# Altium schematic sheet EPS_MPPT_Y_OR_MPB.SchDoc: MPPT-Y / MPB ORing
size A4; SheetNumber: 23; SheetTotal: 51
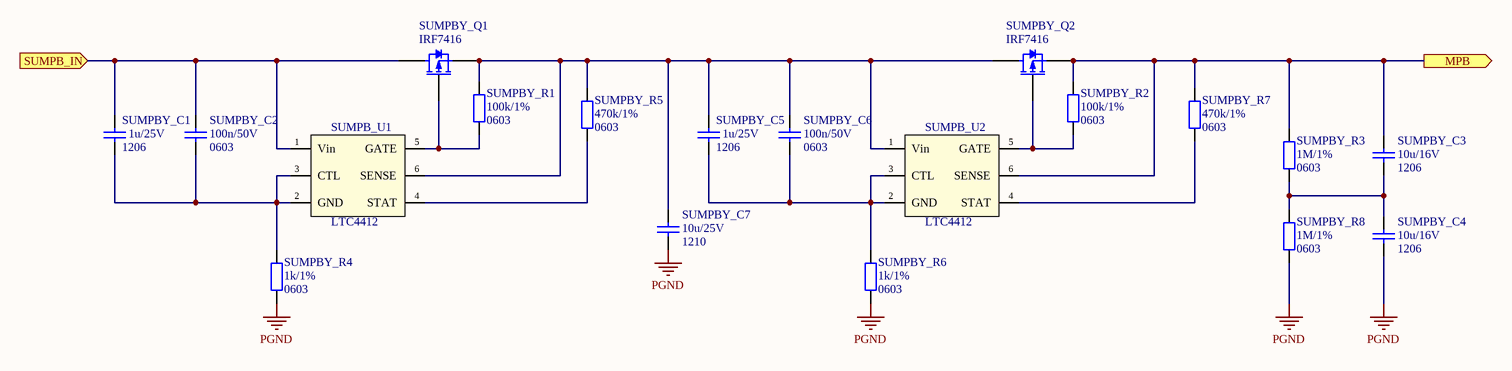
[diagram p0: EPS_MPPT_Y_OR_MPB.SchDoc]

## Parts
SUMPB_U1  LTC4412  [SOT23-6]
SUMPB_U2  LTC4412  [SOT23-6]
SUMPBY_C1  Package: 1206  [SMD_Capacitor_1206]  (hidden comment: 1u/25V)
SUMPBY_C2  Package: 0603  [SMD_Capacitor_0603]  (hidden comment: 100n/50V)
SUMPBY_C3  Packge: 1206  [SMD_Capacitor_1206]  (hidden comment: 10u/16V)
SUMPBY_C4  Packge: 1206  [SMD_Capacitor_1206]  (hidden comment: 10u/16V)
SUMPBY_C5  Package: 1206  [SMD_Capacitor_1206]  (hidden comment: 1u/25V)
SUMPBY_C6  Package: 0603  [SMD_Capacitor_0603]  (hidden comment: 100n/50V)
SUMPBY_C7  Package: 1210  [SMD_Capacitor_1210]  (hidden comment: 10u/25V)
SUMPBY_Q1  IRF7416  [SOIC-8-N_SSSGDDDD]
SUMPBY_Q2  IRF7416  [SOIC-8-N_SSSGDDDD]
SUMPBY_R1  Package: 0603  [SMD_Resistor_0603]  (hidden comment: 100k/1%)
SUMPBY_R2  Package: 0603  [SMD_Resistor_0603]  (hidden comment: 100k/1%)
SUMPBY_R3  Package: 0603  [SMD_Resistor_0603]  (hidden comment: 1M/1%)
SUMPBY_R4  Package: 0603  [SMD_Resistor_0603]  (hidden comment: 1k/1%)
SUMPBY_R5  Package: 0603  [SMD_Resistor_0603]  (hidden comment: 470k/1%)
SUMPBY_R6  Package: 0603  [SMD_Resistor_0603]  (hidden comment: 1k/1%)
SUMPBY_R7  Package: 0603  [SMD_Resistor_0603]  (hidden comment: 470k/1%)
SUMPBY_R8  Package: 0603  [SMD_Resistor_0603]  (hidden comment: 1M/1%)

## Ports
MPB (out), SUMPB_IN (in)

## Nets
PGND: SUMPBY_C4.2 SUMPBY_C7.2 SUMPBY_R4.2 SUMPBY_R6.2 SUMPBY_R8.2
MPB: SUMPB_U2.6(SENSE) SUMPBY_C3.1 SUMPBY_Q2.S SUMPBY_R2.1 SUMPBY_R3.1 SUMPBY_R7.1 ; port MPB
SUMPB_IN: SUMPB_U1.1(Vin) SUMPBY_C1.1 SUMPBY_C2.1 SUMPBY_Q1.D ; port SUMPB_IN
NetSUMPB_U1_2: SUMPB_U1.2(GND) SUMPB_U1.3(CTL) SUMPBY_C1.2 SUMPBY_C2.2 SUMPBY_R4.1
NetSUMPB_U1_4: SUMPB_U1.4(STAT) SUMPBY_R5.2
NetSUMPB_U1_5: SUMPB_U1.5(GATE) SUMPBY_Q1.G SUMPBY_R1.2
NetSUMPB_U1_6: SUMPB_U1.6(SENSE) SUMPB_U2.1(Vin) SUMPBY_C5.1 SUMPBY_C6.1 SUMPBY_C7.1 SUMPBY_Q1.S SUMPBY_Q2.D SUMPBY_R1.1 SUMPBY_R5.1
NetSUMPB_U2_2: SUMPB_U2.2(GND) SUMPB_U2.3(CTL) SUMPBY_C5.2 SUMPBY_C6.2 SUMPBY_R6.1
NetSUMPB_U2_4: SUMPB_U2.4(STAT) SUMPBY_R7.2
NetSUMPB_U2_5: SUMPB_U2.5(GATE) SUMPBY_Q2.G SUMPBY_R2.2
NetSUMPBY_C3_2: SUMPBY_C3.2 SUMPBY_C4.1 SUMPBY_R3.2 SUMPBY_R8.1

## Notes on the sheet
- Title:
- Project:
- Author:
- Model:
- Document Number:
- Checked by:
- Rev:
- Date:
- Approved by:
- Sheet:
- of
- File name:

## Library data of the parts
SUMPB_U1 SUMPB_U2 = LTC4412: Ideal Diode, Low Loss PowerPath Controller.; Manufacturer: Linear Technology; Value: LTC4412
SUMPBY_C1 SUMPBY_C5 = Cer_C1206T105K3RALTU: Ceramic Cap Kemet COTS 1u/25V X7R 1206; ManufacturerPartNumber: C1206T105K3RALTU; Manufacturer: Kemet; Value: 1u/25V
SUMPBY_C2 SUMPBY_C6 = Cer_GCJ188R71H104KA12D: Ceramic Cap Murata Automotive 100n/50V X7R 0603; Manufacturer: Murata; ManufacturerPartNumber: GCJ188R71H104KA12D; Value: 100n/50V
SUMPBY_C3 SUMPBY_C4 = Cer_C1206T106K4RACTU: Ceramic Cap Kemet COTS 10u/16V X7R 1206; ManufacturerPartNumber: C1206T106K4RACTU; Manufacturer: Kemet; Value: 10u/16V
SUMPBY_C7 = Cer_GCJ32ER71E106KA12L: Ceramic Cap Murata Automotive 10u/25V X7R 1210; Manufacturer: Murata; ManufacturerPartNumber: GCJ32ER71E106KA12L; Value: 10u/25V
SUMPBY_Q1 SUMPBY_Q2 = IRF7416: 10A/30V HEXFET Power P-MOSFET.; Manufacturer: International Rectifier; Value: IRF7416
SUMPBY_R1-SUMPBY_R8 = Res
  SUMPBY_R1 SUMPBY_R2: Value: 100k/1%
  SUMPBY_R3 SUMPBY_R8: Value: 1M/1%
  SUMPBY_R4 SUMPBY_R6: Value: 1k/1%
  SUMPBY_R5 SUMPBY_R7: Value: 470k/1%